# EAGLE design untitled (EAGLE 7.7.0)
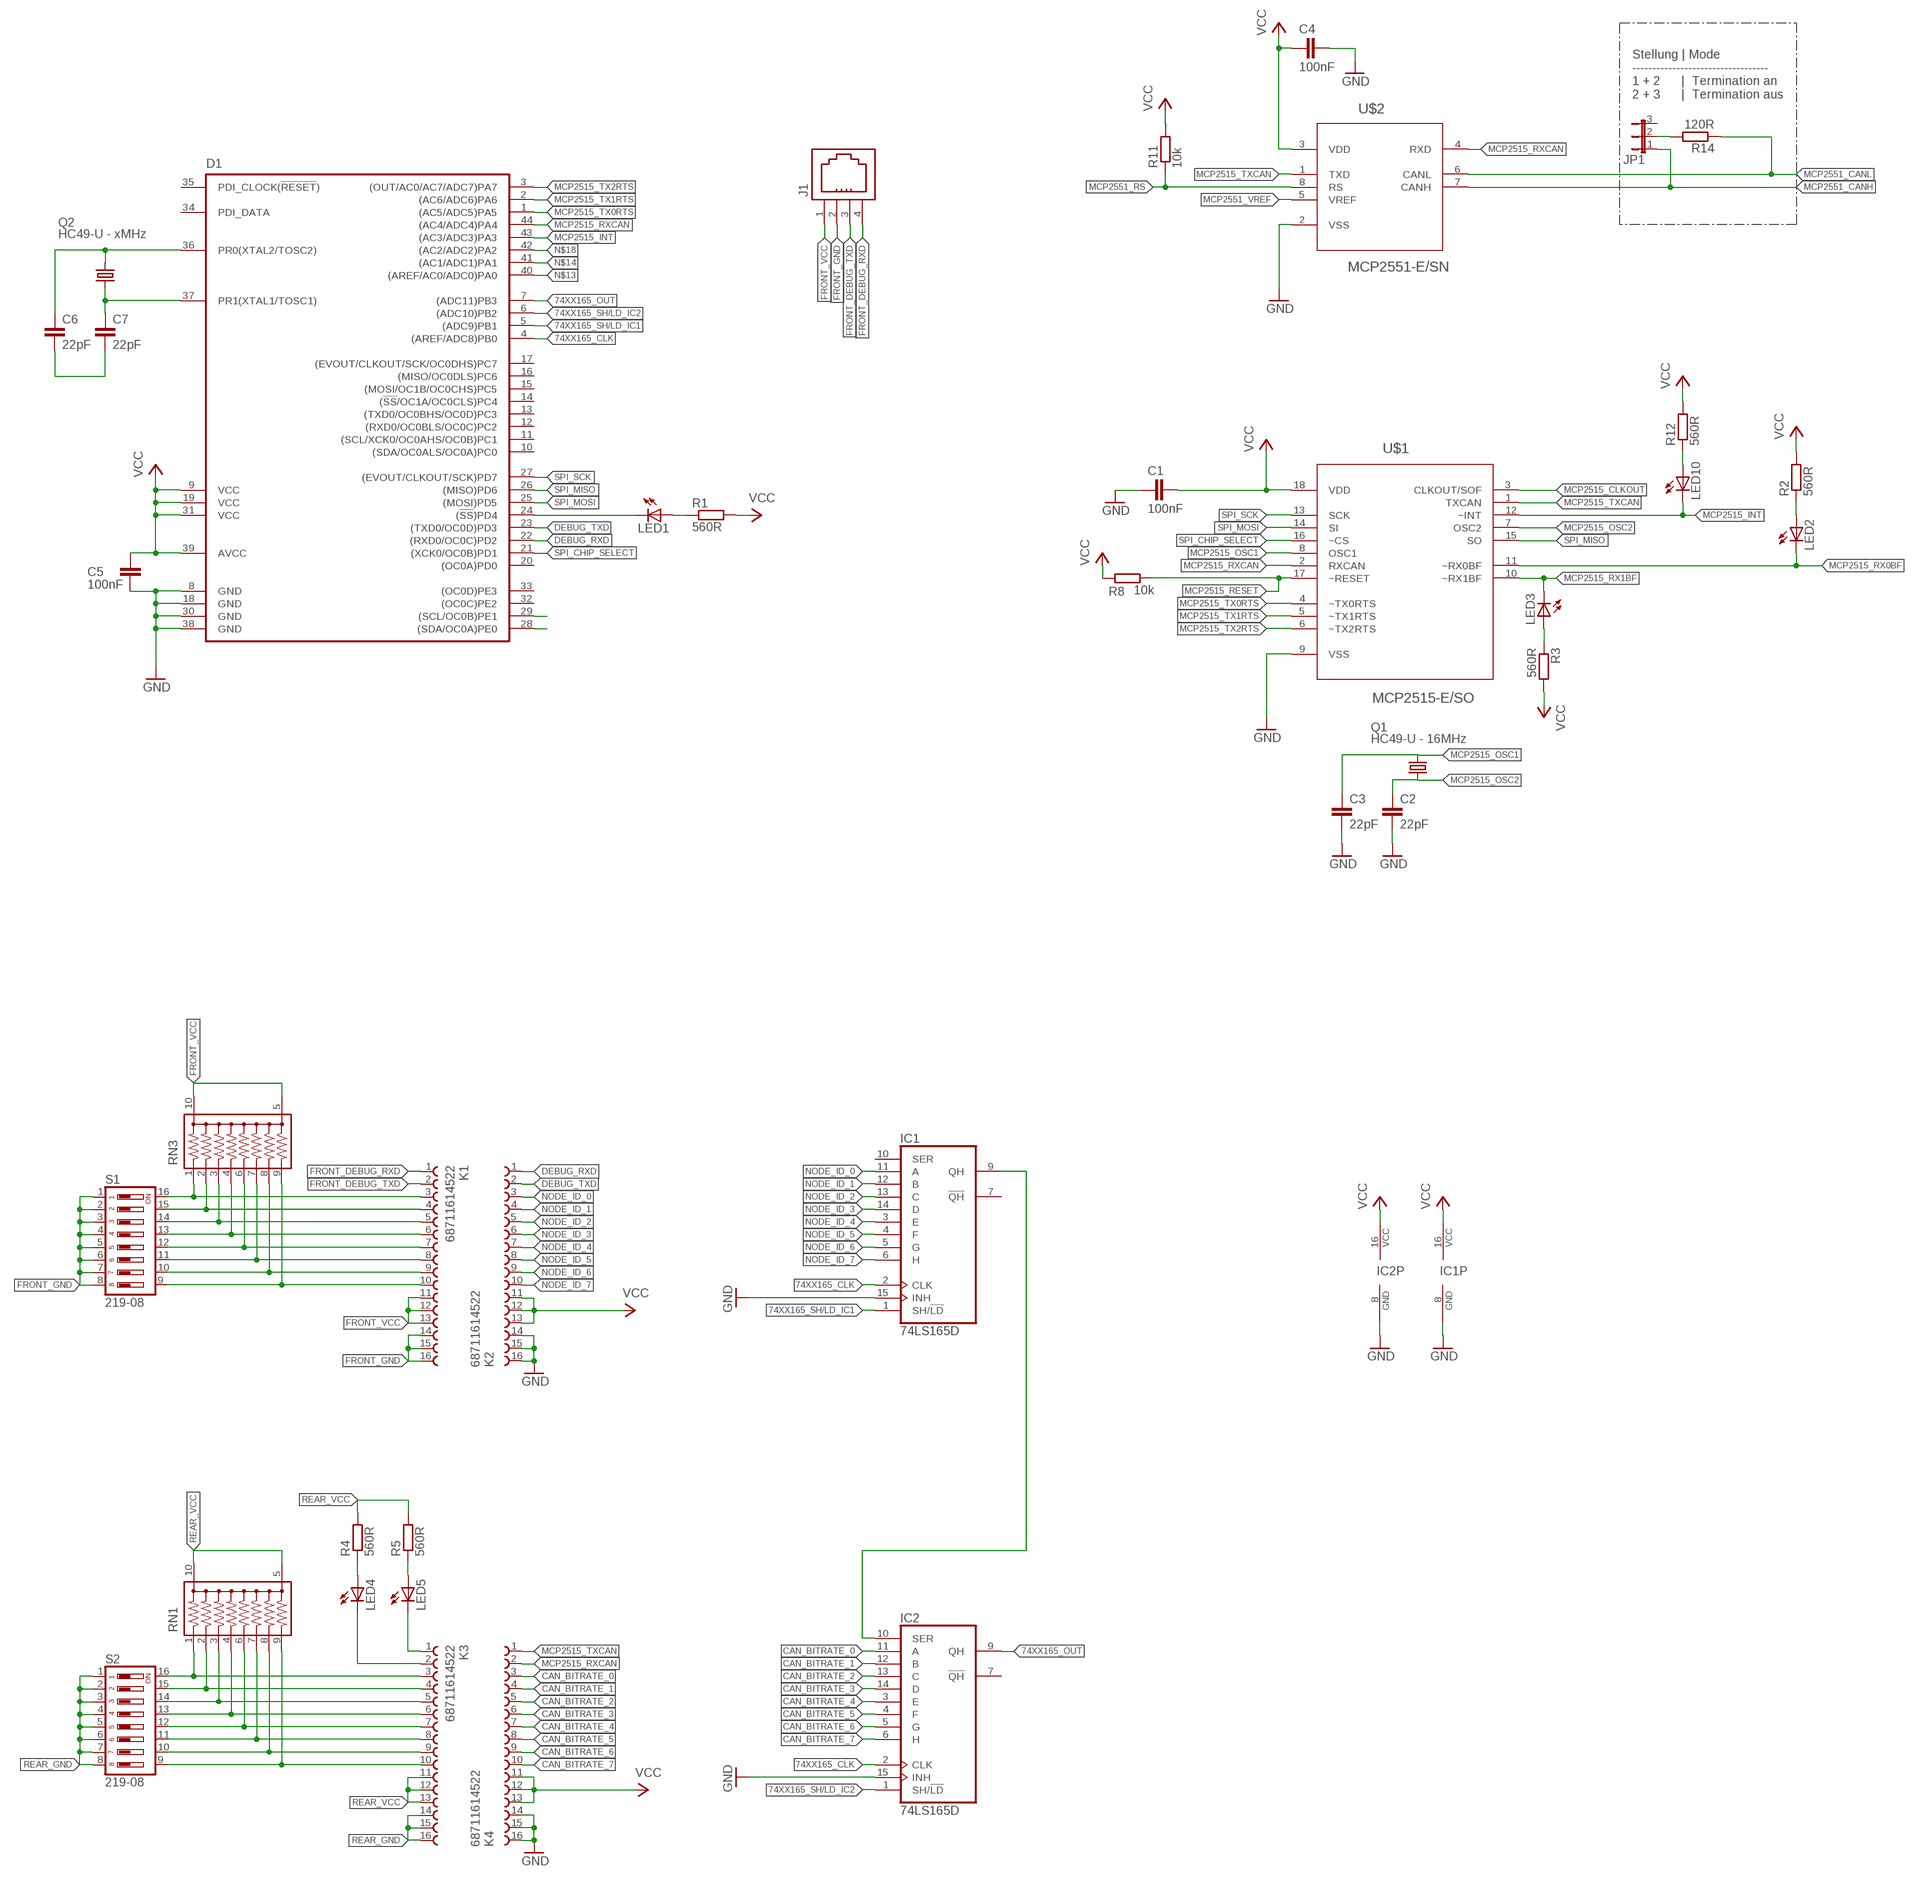
[diagram p0: schematic, sheet 1]

## Parts
C1  100nF  C-EUC1206  [C1206]
C2  22pF  C-EUC1206  [C1206]
C3  22pF  C-EUC1206  [C1206]
C4  100nF  C-EUC1206  [C1206]
C5  100nF  C-EUC1206  [C1206]
C6  22pF  C-EUC1206  [C1206]
C7  22pF  C-EUC1206  [C1206]
D1  ATXMEGA16D4/32D4/64D4/128D4-A  [TQFP44A]
IC1  74LS165D  [SO16]
IC2  74LS165D  [SO16]
J1  615004143821  [615004143821]
JP1  JP2E  [JP2]
K1  68711614522  [68711614522]
K2  68711614522  [68711614522]
K3  68711614522  [68711614522]
K4  68711614522  [68711614522]
LED1  LEDSML1206  [SML1206]
LED2  LEDSML1206  [SML1206]
LED3  LEDSML1206  [SML1206]
LED4  LEDSML1206  [SML1206]
LED5  LEDSML1206  [SML1206]
LED10  LEDSML1206  [SML1206]
Q1  HC49-U - 16MHz  HC49-U  [HC49]
Q2  HC49-U - xMHz  HC49-U  [HC49]
R1  560R  R-EU_R1206  [R1206]
R2  560R  R-EU_R1206  [R1206]
R3  560R  R-EU_R1206  [R1206]
R4  560R  R-EU_R1206  [R1206]
R5  560R  R-EU_R1206  [R1206]
R8  10k  R-EU_R1206  [R1206]
R11  10k  R-EU_R1206  [R1206]
R12  560R  R-EU_R1206  [R1206]
R14  120R  R-EU_R1206  [R1206]
RN1  745-10  [745-10]
RN3  745-10  [745-10]
S1  219-08  [CTS-219-08]
S2  219-08  [CTS-219-08]
U$1  MCP2515-E/SO  [SOIC127P1030X265-18N]
U$2  MCP2551-E/SN  [SOIC127P600X175-8N]

## Nets
74XX165_CLK: D1.4((AREF/ADC8)PB0) IC1.2(CLK) IC2.2(CLK)
74XX165_OUT: D1.7((ADC11)PB3) IC2.9(QH)
74XX165_SH/LD_IC1: D1.5((ADC9)PB1) IC1.1(SH/!LD)
74XX165_SH/LD_IC2: D1.6((ADC10)PB2) IC2.1(SH/!LD)
CAN_BITRATE_0: IC2.11(A) K4.3
CAN_BITRATE_1: IC2.12(B) K4.4
CAN_BITRATE_2: IC2.13(C) K4.5
CAN_BITRATE_3: IC2.14(D) K4.6
CAN_BITRATE_4: IC2.3(E) K4.7
CAN_BITRATE_5: IC2.4(F) K4.8
CAN_BITRATE_6: IC2.5(G) K4.9
CAN_BITRATE_7: IC2.6(H) K4.10
DEBUG_RXD: D1.22((RXD0/OC0C)PD2) K2.1
DEBUG_TXD: D1.23((TXD0/OC0D)PD3) K2.2
FRONT_DEBUG_RXD: J1.4 K1.1
FRONT_DEBUG_TXD: J1.3 K1.2
FRONT_GND: J1.2 K1.14 K1.15 K1.16 S1.1 S1.2 S1.3 S1.4 S1.5 S1.6 S1.7 S1.8
FRONT_VCC: J1.1 K1.11 K1.12 K1.13 RN3.5 RN3.10
GND: C1.2 C2.2 C3.2 C4.1 C5.2 D1.8(GND) D1.18(GND) D1.30(GND) D1.38(GND) IC1.8(GND) IC1.15(INH) IC2.8(GND) IC2.15(INH) K2.14 K2.15 K2.16 K4.14 K4.15 K4.16 U$1.9(VSS) U$2.2(VSS)
MCP2515_CLKOUT: U$1.3(CLKOUT/SOF)
MCP2515_INT: D1.43((AC3/ADC3)PA3) LED10.C U$1.12(~INT)
MCP2515_OSC1: C3.1 Q1.2 U$1.8(OSC1)
MCP2515_OSC2: C2.1 Q1.1 U$1.7(OSC2)
MCP2515_RESET: R8.1 U$1.17(~RESET)
MCP2515_RX0BF: LED2.C U$1.11(~RX0BF)
MCP2515_RX1BF: LED3.C U$1.10(~RX1BF)
MCP2515_RXCAN: D1.44((AC4/ADC4)PA4) K4.2 U$1.2(RXCAN) U$2.4(RXD)
MCP2515_TX0RTS: D1.1((AC5/ADC5)PA5) U$1.4(~TX0RTS)
MCP2515_TX1RTS: D1.2((AC6/ADC6)PA6) U$1.5(~TX1RTS)
MCP2515_TX2RTS: D1.3((OUT/AC0/AC7/ADC7)PA7) U$1.6(~TX2RTS)
MCP2515_TXCAN: K4.1 U$1.1(TXCAN) U$2.1(TXD)
MCP2551_CANH: JP1.1 U$2.7(CANH)
MCP2551_CANL: R14.1 U$2.6(CANL)
MCP2551_RS: R11.1 U$2.8(RS)
MCP2551_VREF: U$2.5(VREF)
N$1: LED2.A R2.1
N$2: IC1.9(QH) IC2.10(SER)
N$3: LED3.A R3.1
N$4: K3.3 RN1.1 S2.16
N$5: K3.4 RN1.2 S2.15
N$6: K3.5 RN1.3 S2.14
N$7: K3.6 RN1.4 S2.13
N$8: K3.7 RN1.6 S2.12
N$9: K3.8 RN1.7 S2.11
N$11: LED10.A R12.1
N$12: JP1.2 R14.2
N$13: D1.40((AREF/AC0/ADC0)PA0)
N$14: D1.41((AC1/ADC1)PA1)
N$15: C6.1 D1.36(PR0(XTAL2/TOSC2)) Q2.2
N$16: C7.1 D1.37(PR1(XTAL1/TOSC1)) Q2.1
N$17: C6.2 C7.2
N$18: D1.42((AC2/ADC2)PA2)
N$19: K3.9 RN1.8 S2.10
N$20: D1.28((SDA/OC0A)PE0)
N$21: D1.29((SCL/OC0B)PE1)
N$22: K1.3 RN3.1 S1.16
N$23: K1.4 RN3.2 S1.15
N$24: K1.5 RN3.3 S1.14
N$25: K1.6 RN3.4 S1.13
N$26: K1.7 RN3.6 S1.12
N$27: K1.8 RN3.7 S1.11
N$28: K1.9 RN3.8 S1.10
N$29: K1.10 RN3.9 S1.9
N$30: K3.10 RN1.9 S2.9
N$32: LED1.A R1.1
N$33: K3.1 LED5.C
N$34: K3.2 LED4.C
N$35: LED4.A R4.1
N$36: LED5.A R5.1
NODE_ID_0: IC1.11(A) K2.3
NODE_ID_1: IC1.12(B) K2.4
NODE_ID_2: IC1.13(C) K2.5
NODE_ID_3: IC1.14(D) K2.6
NODE_ID_4: IC1.3(E) K2.7
NODE_ID_5: IC1.4(F) K2.8
NODE_ID_6: IC1.5(G) K2.9
NODE_ID_7: IC1.6(H) K2.10
REAR_GND: K3.14 K3.15 K3.16 S2.1 S2.2 S2.3 S2.4 S2.5 S2.6 S2.7 S2.8
REAR_VCC: K3.11 K3.12 K3.13 R4.2 R5.2 RN1.5 RN1.10
SPI_CHIP_SELECT: D1.21((XCK0/OC0B)PD1) U$1.16(~CS)
SPI_MISO: D1.26((MISO)PD6) U$1.15(SO)
SPI_MOSI: D1.25((MOSI)PD5) U$1.14(SI)
SPI_SCK: D1.27((EVOUT/CLKOUT/SCK)PD7) U$1.13(SCK)
SPI_SLAVE_SELECT_HW: D1.24((!SS!)PD4) LED1.C
VCC: C1.1 C4.2 C5.1 D1.9(VCC) D1.19(VCC) D1.31(VCC) D1.39(AVCC) IC1.16(VCC) IC2.16(VCC) K2.11 K2.12 K2.13 K4.11 K4.12 K4.13 R1.2 R2.2 R3.2 R8.2 R11.2 R12.2 U$1.18(VDD) U$2.3(VDD)
Unconnected: D1.10((SDA/OC0ALS/OC0A)PC0) D1.11((SCL/XCK0/OC0AHS/OC0B)PC1) D1.12((RXD0/OC0BLS/OC0C)PC2) D1.13((TXD0/OC0BHS/OC0D)PC3) D1.14((!SS!/OC1A/OC0CLS)PC4) D1.15((MOSI/OC1B/OC0CHS)PC5) D1.16((MISO/OC0DLS)PC6) D1.17((EVOUT/CLKOUT/SCK/OC0DHS)PC7) D1.20((OC0A)PD0) D1.32((OC0C)PE2) D1.33((OC0D)PE3) D1.34(PDI_DATA) D1.35(PDI_CLOCK(!RESET!)) IC1.7(!QH) IC1.10(SER) IC2.7(!QH) JP1.3

## Notes on the sheet
- Stellung | Mode
  ----------------------------------
  1 + 2      |  Termination an
  2 + 3      |  Termination aus

## Library data of the parts
C1-C7 = rcl:C-EU: CAPACITOR, European symbol
D1 = AVR - XMEGA:ATXMEGA16D4/32D4/64D4/128D4-: Name des Bauteiles: -->ATxmega32D4-AU Daten:SMD-Microcontroller 8/16 Bit Artikelnummer:#045426 Datenblatt:Siehe Hesch Suche ! __________________________________________ generated by Eagle Description Tool am : 14.02.2017 11:35:40 erstellt von: Hm
IC1 IC2 = 74xx-us:74*165: 8-bit parallel load SHIFT REGISTER
J1 = InputOutputIO (rev18b):615004143821: WR-MJ Horizontal Plastic 4P4C Modular Jack Tab Up, 4 Pins=>Code : Con_I-O_MJ-H_Plastic_Up_615004143821 <http://katalog.we-online.de/media/images/eican/Con_I-O_MJ-H_Plastic_Up_615004143821_pf2.jpg> Details see: http://katalog.we-online.de/en/em/MJ_HORIZONTAL_PLASTIC_4P4C_TAB_UP Created 2014-07-10, Karrer Zheng 2014 (C) Würth Elektronik
JP1 = jumper:JP2E: JUMPER
K1-K4 = Wurth_FPC_FFC:68711614522: WE-FPC 0.5mm SMT ZIF Horizontal Bottom Contact, 16 Pins=>Code : Con_FPC_ZIF_0.50_68711614522 <http://katalog.we-online.de/media/images/eican/Con_FPC_ZIF_0.50_6871xx14522_pf2.jpg> Details see: http://katalog.we-online.de/en/em/687_1xx_145_22 Created 2014-07-09, Karrer Zheng 2014 (C) Würth Elektronik
LED1-LED5 LED10 = led:LED: LED OSRAM: - CHIPLED LG R971, LG N971, LY N971, LG Q971, LY Q971, LO R971, LY R971 LH N974, LH R974 LS Q976, LO Q976, LY Q976 LO Q996 - Hyper CHIPLED LW Q18S LB Q993, LB Q99A, LB R99A - SideLED LS A670, LO A670, LY A670, LG A670, LP A670 LB A673, LV A673, LT A673, LW A673 LH A674 LY A675 LS A676, LA A676, LO A676, LY A676, LW A676 LS A679, LY A679, LG A679 - Hyper Micro SIDELED® LS Y876, LA Y876, LO Y876, LY Y876 LT Y87S - SmartLED LW L88C, LW L88S LB L89C, LB L89S, LG L890 LS L89K, LO L89K, LY L89K LS L896, LA L896, LO L896, LY L896 - TOPLED LS T670, LO T670, LY T670, LG T670, LP T670 LSG T670, LSP T670, LSY T670, LOP T670, LYG T670 LG T671, LOG T671, LSG T671 LB T673, LV T673, LT T673, LW T673 LH T674 LS T676, LA T676, LO T676, LY T676, LB T676, LH T676, LSB T676, LW T676 LB T67C, LV T67C, LT T67C, LS T67K, LO T67K, LY T67K, LW E67C LS E67B, LA E67B, LO E67B, LY E67B, LB E67C, LV E67C, LT E67C LW T67C LS T679, LY T679, LG T679 LS T770, LO T770, LY T770, LG T770, LP T770 LB T773, LV T773, LT T773, LW T773 LH T774 LS E675, LA E675, LY E675, LS T675 LS T776, LA T776, LO T776, LY T776, LB T776 LHGB T686 LT T68C, LB T68C - Hyper Mini TOPLED® LB M676 - Mini TOPLED Santana® LG M470 LS M47K, LO M47K, LY M47K Source: http://www.osram.convergy.de LUXEON: - LUMILED® LXK2-PW12-R00, LXK2-PW12-S00, LXK2-PW14-U00, LXK2-PW14-V00 LXK2-PM12-R00, LXK2-PM12-S00, LXK2-PM14-U00 LXK2-PE12-Q00, LXK2-PE12-R00, LXK2-PE12-S00, LXK2-PE14-T00, LXK2-PE14-U00 LXK2-PB12-K00, LXK2-PB12-L00, LXK2-PB12-M00, LXK2-PB14-N00, LXK2-PB14-P00, LXK2-PB14-Q00 LXK2-PR12-L00, LXK2-PR12-M00, LXK2-PR14-Q00, LXK2-PR14-R00 LXK2-PD12-Q00, LXK2-PD12-R00, LXK2-PD12-S00 LXK2-PH12-R00, LXK2-PH12-S00 LXK2-PL12-P00, LXK2-PL12-Q00, LXK2-PL12-R00 Source: www.luxeon.com KINGBRIGHT: KA-3528ASYC Source: www.kingbright.com
Q1 Q2 = Quarz - HC49UP:HC49: Name des Bauteiles: -->HC49U/P Daten:16 MHz (16000000 Hz) Artikelnummer:#023006 Datenblatt:www.alldatasheet.com __________________________________________ generated by Eagle Description Tool am : 22.01.2014 13:23:52 erstellt von: Hm
R1-R5 R8 R11 R12 R14 = rcl:R-EU_: RESISTOR, European symbol
RN1 RN3 = resistor-array:745-10: CTS 745 Series 8 Resistors, 10 Terminations
S1 S2 = switch-dil:219-08*: Surface Mount DIP Switch Series 219 SMT CTS Electronic Components Sourc: www.ctscorp.com; OC_FARNELL: unknown; OC_NEWARK: unknown
U$1 = Microchip_By_element14_Batch_1:MCP2515-E/SO: Stand-Alone CAN Controller; DESCRIPTION: IC CAN CONTROLLER; MPN: MCP2515-E/SO; OC_FARNELL: 1605565; OC_NEWARK: 29H7134; PACKAGE: SOIC-18; SUPPLIER: Microchip
U$2 = Microchip_By_element14_Batch_1:MCP2551-E/SN: High-Speed CAN Transceiver; DESCRIPTION: High-Speed CAN Transceiver; MPN: MCP2551-E/SN; OC_FARNELL: 1467746; OC_NEWARK: 92C4186; PACKAGE: SOIC-8; SUPPLIER: Microchip

## Board
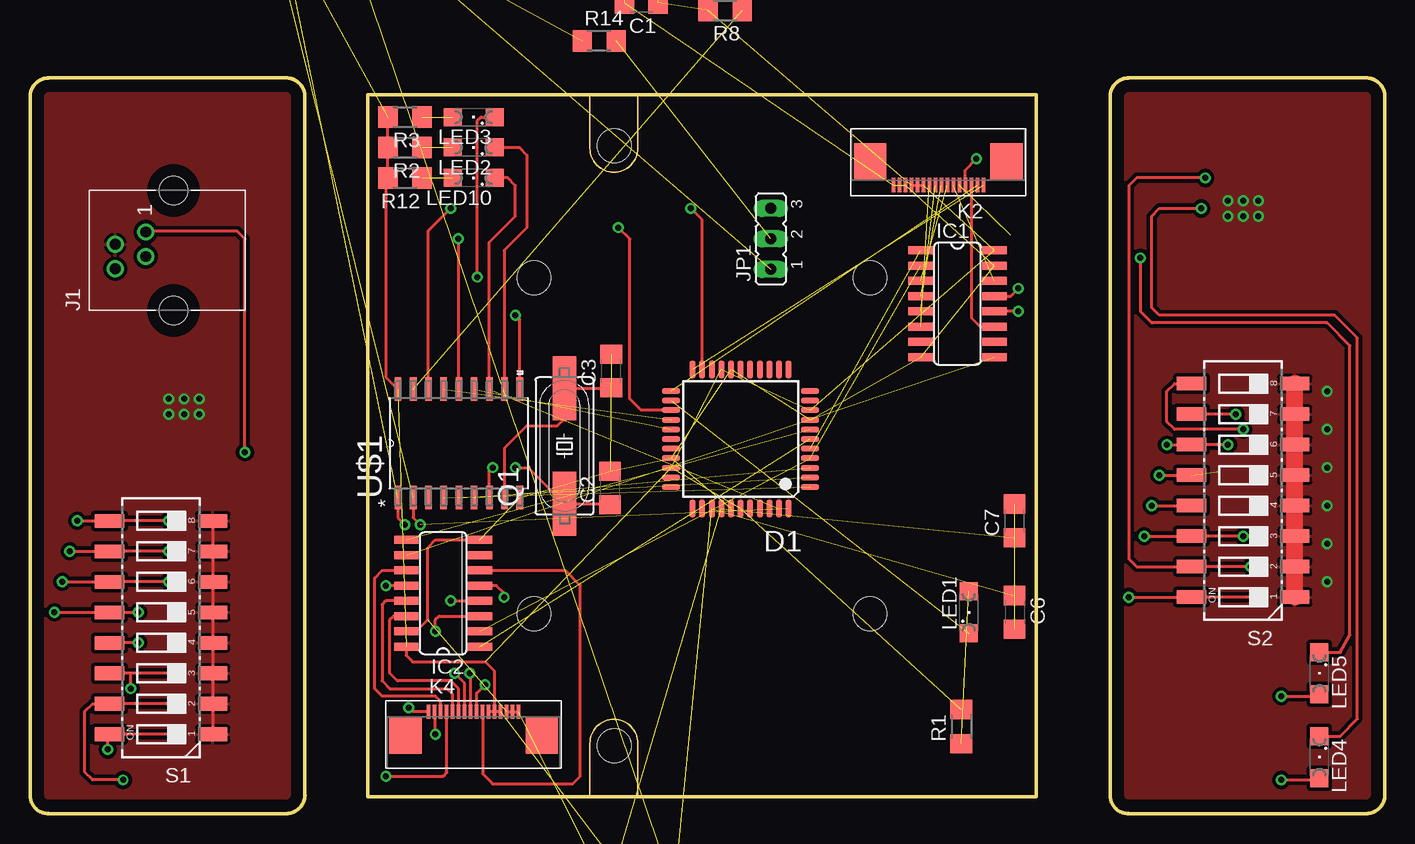
[diagram p1: board, top side]
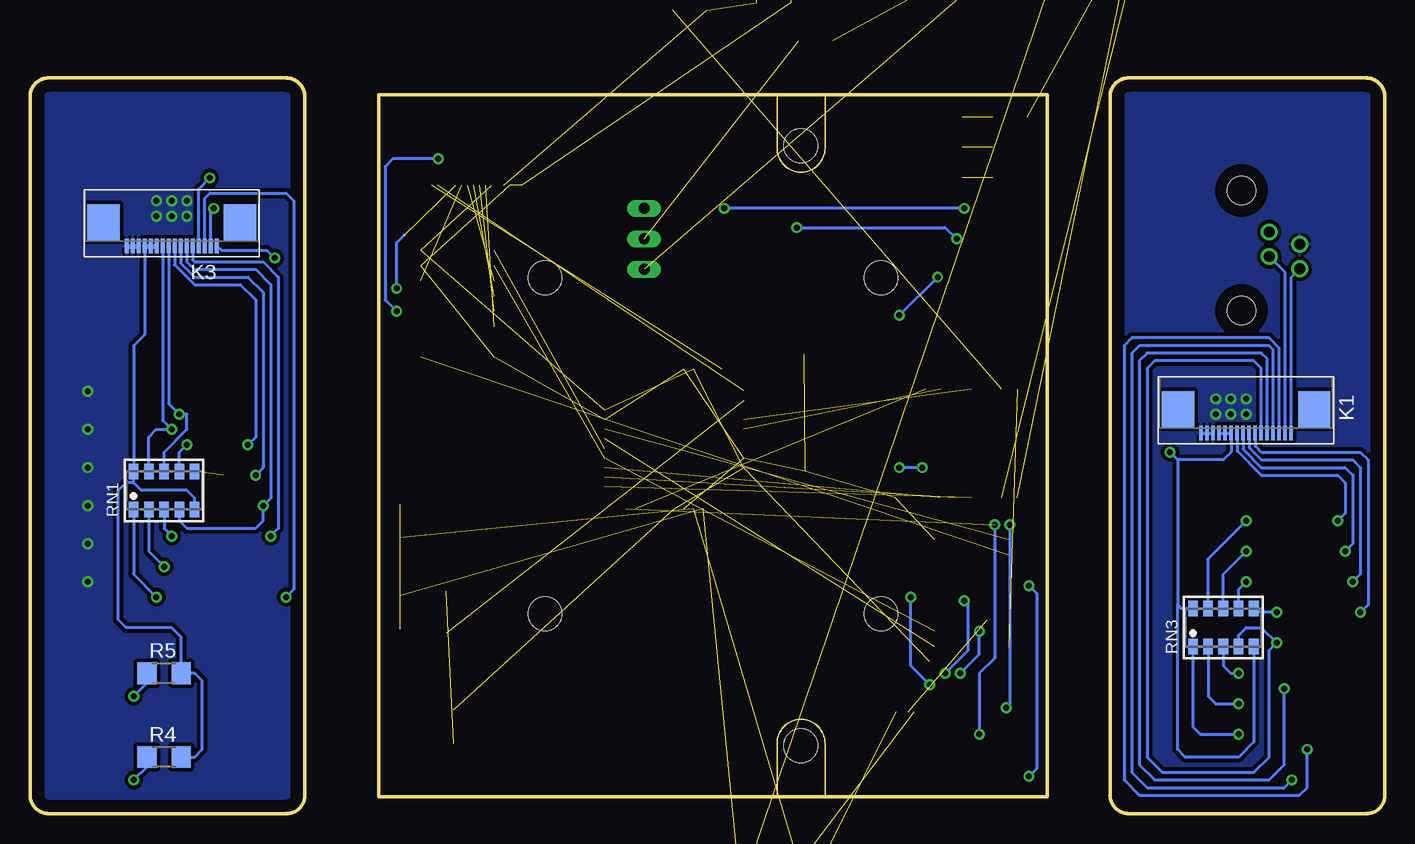
[diagram p2: board, bottom side, seen from below]

Size 112.91 x 61.32 mm. Coordinates in mm from the lower left corner, seen from the top.
Copper layers (1*16): Top 0.035mm / dielectric 1.5mm / Bottom 0.035mm
Design rules "default": minimum track width 10mil, minimum drill 24mil, track to track 8mil, track to pad 8mil, pad to pad 8mil, via to via 8mil, smd to smd 8mil, copper to edge 40mil, drill to drill 8mil, minimum pad ring 10mil, minimum via ring 8mil, stop-mask expansion 4mil, vias tented up to drill 0mil, thermal gap 10mil

### Footprints (pad centres in the part's own frame; a part is rotated, then mirrored left to right if it is on the bottom)
C1206 = smd 1.6 x 1.8: 1 -1.4,0; 2 1.4,0
TQFP44A = smd 1.5 x 0.5: 1 -5.8,4; 2 -5.8,3.2; 3 -5.8,2.4; 4 -5.8,1.6; 5 -5.8,0.8; 6 -5.8,0; 7 -5.8,-0.8; 8 -5.8,-1.6; 9 -5.8,-2.4; 10 -5.8,-3.2; 11 -5.8,-4; 23 5.8,-4; 24 5.8,-3.2; 25 5.8,-2.4; 26 5.8,-1.6; 27 5.8,-0.8; 28 5.8,0; 29 5.8,0.8; 30 5.8,1.6; 31 5.8,2.4; 32 5.8,3.2; 33 5.8,4 | smd 0.5 x 1.5: 12 -4,-5.8; 13 -3.2,-5.8; 14 -2.4,-5.8; 15 -1.6,-5.8; 16 -0.8,-5.8; 17 0,-5.8; 18 0.8,-5.8; 19 1.6,-5.8; 20 2.4,-5.8; 21 3.2,-5.8; 22 4,-5.8; 34 4,5.8; 35 3.2,5.8; 36 2.4,5.8; 37 1.6,5.8; 38 0.8,5.8; 39 0,5.8; 40 -0.8,5.8; 41 -1.6,5.8; 42 -2.4,5.8; 43 -3.2,5.8; 44 -4,5.8
SO16 = smd 0.66 x 2.032: 1 -4.445,-3.073; 2 -3.175,-3.073; 3 -1.905,-3.073; 4 -0.635,-3.073; 5 0.635,-3.073; 6 1.905,-3.073; 7 3.175,-3.073; 8 4.445,-3.073; 9 4.445,3.073; 10 3.175,3.073; 11 1.905,3.073; 12 0.635,3.073; 13 -0.635,3.073; 14 -1.905,3.073; 15 -3.175,3.073; 16 -4.445,3.073
615004143821 = drill 0.9: 1 1.53,2.3; 2 0.51,4.84; 3 -0.51,2.3; 4 -1.53,4.84 | hole 2.36: -5,0; 5,0
JP2 = drill 0.914 long: 1 -2.54,0; 2 0,0; 3 2.54,0
68711614522 = smd 0.3 x 1.2: 1 -3.75,0.6; 2 -3.25,0.6; 3 -2.75,0.6; 4 -2.25,0.6; 5 -1.75,0.6; 6 -1.25,0.6; 7 -0.75,0.6; 8 -0.25,0.6; 9 0.25,0.6; 10 0.75,0.6; 11 1.25,0.6; 12 1.75,0.6; 13 2.25,0.6; 14 2.75,0.6; 15 3.25,0.6; 16 3.75,0.6 | smd 2.7 x 3: Z1 -5.68,-1.38; Z2 5.68,-1.38
SML1206 = smd 1.5 x 1.5: A 1.75,0; C -1.75,0
HC49 = smd 5.334 x 1.93: 1 -4.826,0; 2 4.826,0
R1206 = smd 1.6 x 1.803: 1 -1.422,0; 2 1.422,0
745-10 = smd 0.8 x 1.3: 1 -2.54,-1.587; 2 -1.27,-1.587; 3 0,-1.587; 4 1.27,-1.587; 5 2.54,-1.587; 6 2.54,1.587; 7 1.27,1.587; 8 0,1.587; 9 -1.27,1.587; 10 -2.54,1.587
CTS-219-08 = smd 1.13 x 2.44: 1 -8.89,-4.3; 2 -6.35,-4.3; 3 -3.81,-4.3; 4 -1.27,-4.3; 5 1.27,-4.3; 6 3.81,-4.3; 7 6.35,-4.3; 8 8.89,-4.3; 9 8.89,4.3; 10 6.35,4.3; 11 3.81,4.3; 12 1.27,4.3; 13 -1.27,4.3; 14 -3.81,4.3; 15 -6.35,4.3; 16 -8.89,4.3
SOIC127P1030X265-18N = smd 1.981 x 0.559: 1 -4.521,5.08; 2 -4.521,3.81; 3 -4.521,2.54; 4 -4.521,1.27; 5 -4.521,0; 6 -4.521,-1.27; 7 -4.521,-2.54; 8 -4.521,-3.81; 9 -4.521,-5.08; 10 4.521,-5.08; 11 4.521,-3.81; 12 4.521,-2.54; 13 4.521,-1.27; 14 4.521,0; 15 4.521,1.27; 16 4.521,2.54; 17 4.521,3.81; 18 4.521,5.08
SOIC127P600X175-8N = smd 1.981 x 0.559: 1 -2.362,1.905; 2 -2.362,0.635; 3 -2.362,-0.635; 4 -2.362,-1.905; 5 2.362,-1.905; 6 2.362,-0.635; 7 2.362,0.635; 8 2.362,1.905
RND_455-00879_X4 = hole 2.8: -14,-13.54; 14,-13.54; -14,14.46; 14,14.46; -25,7.78; 25,7.78

### Placement (x,y rotation side)
C1  50.93,67.58 180 top  (outside the outline)
C2  48.35,27.15 90 top
C3  48.44,36.9 90 top
C4  50.3,76.47 0 top  (outside the outline)
C5  50.3,-7.98 180 top  (outside the outline)
C6  82.05,16.78 270 top
C7  82.05,24.4 90 top
D1  59.22,31.23 180 top
IC1  77.29,42.5 270 top
IC2  34.42,18.37 90 top
J1  11.95,46.94 90 top
JP1  61.73,47.9 90 top
K1  11.57,32.31 180 bottom
K2  75.7,52.98 180 top
K3  101.1,47.9 180 bottom
K4  36.96,7.89 0 top
LED1  78.24,16.78 90 top
LED2  36.96,55.52 180 top
LED3  36.96,58.06 180 top
LED4  107.45,4.72 270 top
LED5  107.45,11.7 270 top
LED10  36.96,52.98 180 top
Q1  44.54,30.64 90 top
Q2  46.81,-27.35 0 top  (outside the outline)
R1  77.6,7.26 90 top
R2  31.25,55.52 180 top
R3  31.25,58.06 180 top
R4  101.73,4.72 0 bottom
R5  101.73,11.7 0 bottom
R8  57.92,66.94 180 top  (outside the outline)
R11  55.06,-11.8 270 top  (outside the outline)
R12  31.25,52.98 180 top
R14  47.44,64.41 0 top  (outside the outline)
RN1  101.73,26.94 0 bottom
RN3  13.47,15.51 0 bottom
S1  10.93,15.51 90 top
S2  101.1,26.94 90 top
U$1  35.74,30.86 90 top
U$2  22.31,76.68 0 top  (outside the outline)
U$3  [RND_455-00879_X4]  56.46,30.66 90 top
U$4  [25X25_BEST]  95.38,8.52 100 top

### Tracks (layer width: path | path; a pad name or v marks a point on that pad's centre or on a via)
74XX165_CLK  (2 unrouted)
74XX165_OUT  (1 unrouted)
74XX165_SH/LD_IC1  (1 unrouted)
74XX165_SH/LD_IC2  (1 unrouted)
CAN_BITRATE_0
  Top 0.254: K4.3 34.21,9.37 33.79,9.8 29.35,9.8 28.71,10.43 28.71,19.64 29.35,20.27 IC2.11
CAN_BITRATE_1  (via drill 0.5)
  Top 0.254: IC2.12 v29.66,19 | v29.66,3.13 34.43,3.13 34.74,3.45 34.74,8.46 K4.4
  Bottom 0.254: v29.66,19 29.03,18.37 29.03,3.76 v29.66,3.13
CAN_BITRATE_2
  Top 0.254: IC2.13 29.66,17.73 29.35,17.42 29.35,11.07 29.98,10.43 34.74,10.43 35.21,9.96 K4.5
CAN_BITRATE_3
  Top 0.254: K4.6 35.71,10.41 35.06,11.07 30.61,11.07 29.98,11.7 29.98,16.15 30.3,16.46 IC2.14
CAN_BITRATE_4  (via drill 0.5)
  Top 0.254: K4.7 36.21,10.86 v35.38,11.7 | v33.79,15.19 33.79,16.15 34.11,16.46 IC2.3
  Bottom 0.254: v35.38,11.7 33.79,13.29 v33.79,15.19
CAN_BITRATE_5  (via drill 0.5)
  Top 0.254: K4.8 36.71,11.63 v36.65,11.7 | v35.06,17.73 IC2.4
  Bottom 0.254: v36.65,11.7 34.74,13.61 34.74,17.42 v35.06,17.73
CAN_BITRATE_6  (via drill 0.5)
  Top 0.254: K4.9 37.21,10.05 v37.92,10.75 | v39.5,18.05 39.5,18.37 38.87,19 IC2.5
  Bottom 0.254: v37.92,10.75 39.5,12.34 v39.5,18.05
CAN_BITRATE_7
  Top 0.254: K4.10 37.71,3.33 38.55,2.49 45.22,2.49 45.86,3.13 45.86,19 44.58,20.27 IC2.6
DEBUG_RXD  (1 unrouted)
DEBUG_TXD  (1 unrouted)
FRONT_DEBUG_RXD
  Bottom 0.254: K1.1 7.82,44.7 J1.4
FRONT_DEBUG_TXD
  Bottom 0.254: K1.2 8.32,45.1 J1.3
FRONT_GND  (via drill 0.5)
  Top 0.254: S1.8 S1.7 S1.6 S1.5 S1.4 S1.3 S1.2 S1.1
  Bottom 0.254: K1.16 K1.15 K1.14
  other vias: 14.1,33.29 14.1,34.56 12.83,34.56 12.83,33.29 11.56,33.29 11.56,34.56
  pour Top (isolate 0.305): 23.63,61.87 23.63,-1 -0.5,-1 -0.5,61.87
  pour Bottom (isolate 0.305): 23.63,61.87 23.63,-1 -0.5,-1 -0.5,61.87
FRONT_VCC  (via drill 0.5)
  Top 0.254: v17.92,30.12 17.92,47.9 17.28,48.53 9.71,48.53 J1.1
  Bottom 0.254: K1.13 K1.12 K1.11 12.82,30.13 13.47,29.48 17.28,29.48 | 17.28,29.48 v17.92,30.12 | 17.28,29.48 17.28,17.42 | RN3.10 16.96,17.1 17.28,17.42 | RN3.5 10.93,5.98 12.2,4.72 16.64,4.72 17.28,5.35 17.28,17.42
GND  (17 unrouted)
  Top 0.254: K4.14 K4.15 K4.16 | IC2.15 32.2,15.19 33.15,16.15 33.15,22.18 33.79,22.81 IC2.8
MCP2515_INT  (1 unrouted)
  Top 0.254: U$1.12 38.28,47.62 40.46,49.8 40.46,52.34 39.82,52.98 LED10.C
MCP2515_OSC1
  Top 0.254: C3.1 48.41,35.46 Q1.2 44.58,35.42 44.58,32.97 43.95,32.34 41.41,32.34 39.55,30.48 U$1.8
MCP2515_OSC2  (via drill 0.5)
  Top 0.254: C2.1 48.28,25.81 Q1.1 41.51,28.85 v40.46,28.85 | U$1.7 38.28,28.57 v38.55,28.85
  Bottom 0.254: v38.55,28.85 v40.46,28.85
MCP2515_RESET  (1 unrouted)
MCP2515_RX0BF
  Top 0.254: LED2.C 40.78,55.52 41.41,54.88 41.41,48.85 39.5,46.94 39.5,35.43 U$1.11
MCP2515_RX1BF  (via drill 0.5)
  Top 0.254: U$1.10 40.82,41.18 v40.46,41.55 | v37.28,44.72 37.28,57.74 37.6,58.06 LED3.C
  Bottom 0.254: v40.46,41.55 v37.28,44.72
MCP2515_RXCAN  (via drill 0.5)  (2 unrouted)
  Top 0.254: U$1.2 31.93,24.67 v32.52,24.08 | K4.2 33.71,6.7 v33.79,6.62
  Bottom 0.254: v32.52,24.08 32.52,12.97 33.79,11.7 v33.79,6.62
MCP2515_TX0RTS  (1 unrouted)
MCP2515_TX1RTS  (1 unrouted)
MCP2515_TX2RTS  (1 unrouted)
MCP2515_TXCAN  (via drill 0.5)  (1 unrouted)
  Top 0.254: U$1.1 30.66,24.67 v31.25,24.08 | v31.57,8.84 31.89,8.52 33.18,8.52 K4.1
  Bottom 0.254: v31.25,24.08 31.25,9.16 v31.57,8.84
MCP2551_CANH  (1 unrouted)
MCP2551_CANL  (1 unrouted)
MCP2551_RS  (1 unrouted)
N$1  (1 unrouted)
N$2  (1 unrouted)
N$3  (1 unrouted)
N$4  (via drill 0.5)
  Top 0.254: v91.57,18.05 S2.16 v102.37,18.05
  Bottom 0.254: K3.3 98.35,51.28 97.92,51.7 91.57,51.7 90.94,51.07 90.94,18.69 v91.57,18.05 | RN1.1 104.28,19.96 v102.37,18.05
N$5  (via drill 0.5)
  Top 0.254: v97.92,52.98 92.21,52.98 91.57,52.34 91.57,21.23 92.21,20.59 S2.15 v101.73,20.59
  Bottom 0.254: K3.4 98.85,52.05 v97.92,52.98 | RN1.2 103.01,21.86 v101.73,20.59
N$6  (via drill 0.5)
  Top 0.254: v92.84,23.13 S2.14 v101.1,23.13
  Bottom 0.254: K3.5 99.35,46.15 99.2,45.99 93.48,45.99 92.21,44.72 92.21,23.77 v92.84,23.13 | RN1.3 101.73,23.77 v101.1,23.13
N$7  (via drill 0.5)
  Top 0.254: v93.48,25.67 S2.13
  Bottom 0.254: K3.6 99.85,46.01 99.2,45.36 94.12,45.36 92.84,44.09 92.84,26.3 v93.48,25.67 93.48,24.4 94.12,23.77 99.83,23.77 100.46,24.4 RN1.4
N$8  (via drill 0.5)  (1 unrouted)
  Top 0.254: v94.12,28.21 S2.12
  Bottom 0.254: K3.7 100.35,45.88 99.2,44.72 94.75,44.72 93.48,43.45 93.48,28.85 v94.12,28.21
N$9  (via drill 0.5)
  Top 0.254: v94.75,30.75 S2.11 v99.83,30.75
  Bottom 0.254: K3.8 100.85,45.74 99.2,44.09 95.39,44.09 94.12,42.82 94.12,31.39 v94.75,30.75 | RN1.7 100.46,30.12 v99.83,30.75
N$11  (1 unrouted)
N$12  (1 unrouted)
N$15  (2 unrouted)
N$16  (2 unrouted)
N$17  (1 unrouted)
N$19  (via drill 0.5)
  Top 0.254: v100.46,33.29 S2.10
  Bottom 0.254: K3.9 101.35,34.18 v100.46,33.29 99.83,33.29 99.83,32.02 101.73,30.12 RN1.8
N$22  (via drill 0.5)
  Top 0.254: v12.2,6.62 S1.16 6.48,6.48 v6.48,5.35
  Bottom 0.254: RN3.1 16.01,7.26 15.37,6.62 v12.2,6.62 | K1.3 8.82,38.8 9.66,39.64 21.09,39.64 21.72,39.01 21.72,2.81 20.46,1.54 7.12,1.54 6.48,2.18 v6.48,5.35
N$23  (via drill 0.5)
  Top 0.254: v12.2,9.16 S1.15 5.21,9.16 4.58,8.52 4.58,3.45 5.21,2.81 v7.75,2.81
  Bottom 0.254: RN3.2 14.74,9.8 14.11,9.16 v12.2,9.16 | K1.4 9.32,38.66 9.66,39.01 20.46,39.01 21.09,38.37 21.09,3.45 19.82,2.18 8.39,2.18 v7.75,2.81
N$24  (via drill 0.5)
  Top 0.254: v12.2,11.7 8.39,11.7 | 8.39,11.7 S1.14 | v8.39,10.43 8.39,11.7
  Bottom 0.254: RN3.3 13.47,12.34 12.84,11.7 v12.2,11.7 | K1.5 9.82,37.9 10.29,38.37 19.82,38.37 20.46,37.73 20.46,4.08 19.18,2.81 9.66,2.81 8.39,4.08 v8.39,10.43
N$25  (via drill 0.5)
  Top 0.254: v9.02,14.24 S1.13
  Bottom 0.254: RN3.4 12.2,14.88 11.57,15.51 10.29,15.51 v9.02,14.24 9.66,13.61 9.66,4.72 10.93,3.45 18.55,3.45 19.82,4.72 19.82,37.1 19.18,37.73 10.93,37.73 10.32,37.12 K1.6
N$26  (via drill 0.5)
  Top 0.254: v9.02,16.78 S1.12 v2.04,16.78
  Bottom 0.254: v9.02,16.78 10.61,16.78 RN3.6 | K1.7 10.82,30.64 10.29,30.12 2.04,30.12 1.41,29.48 1.41,17.42 v2.04,16.78
N$27  (via drill 0.5)
  Top 0.254: v11.57,19.32 S1.11 v2.68,19.32
  Bottom 0.254: RN3.7 12.2,18.69 v11.57,19.32 | K1.8 11.32,30.51 10.29,29.48 2.68,29.48 2.04,28.85 2.04,19.96 v2.68,19.32
N$28  (via drill 0.5)
  Top 0.254: v11.57,21.86 S1.10 v3.31,21.86
  Bottom 0.254: RN3.8 13.47,19.96 v11.57,21.86 | K1.9 11.82,30.37 10.29,28.85 3.31,28.85 2.68,28.21 2.68,22.5 v3.31,21.86
N$29  (via drill 0.5)
  Top 0.254: v11.57,24.4 S1.9 v3.95,24.4
  Bottom 0.254: RN3.9 14.74,21.23 v11.57,24.4 | K1.10 12.32,30.23 10.29,28.21 3.95,28.21 3.31,27.58 3.31,25.04 v3.95,24.4
N$30  (via drill 0.5)
  Top 0.254: v101.1,32.02 95.39,32.02 94.75,32.66 94.75,35.2 95.39,35.83 S2.9
  Bottom 0.254: K3.10 101.85,32.77 v101.1,32.02 102.37,32.02 103.01,31.39 RN1.9
N$32  (1 unrouted)
N$33  (via drill 0.5)
  Top 0.254: LED5.C 109.2,13.45 109.99,14.88 109.99,39.01 108.09,40.91 93.48,40.91 92.53,41.86 v92.53,46.31
  Bottom 0.254: K3.1 97.31,47.26 97.29,47.26 96.97,46.94 93.16,46.94 v92.53,46.31
N$34  (via drill 0.5)
  Top 0.254: LED4.C 109.2,6.47 110.62,7.89 110.62,39.64 108.72,41.55 94.12,41.55 93.48,42.18 93.48,49.8 94.12,50.44 v97.61,50.44
  Bottom 0.254: K3.2 97.85,50.19 v97.61,50.44
N$35  (via drill 0.5)
  Top 0.254: v104.28,2.81 107.29,2.81 LED4.A
  Bottom 0.254: R4.1 103.16,3.93 v104.28,2.81
N$36  (via drill 0.5)
  Top 0.254: v104.28,9.8 107.29,9.8 LED5.A
  Bottom 0.254: R5.1 103.16,10.91 v104.28,9.8
NODE_ID_0
  Top 0.254: K2.3 78.45,41.34 79.19,40.59 IC1.11
NODE_ID_1  (via drill 0.5)
  Top 0.254: K2.4 77.95,53.64 v78.87,54.56 | v82.37,41.86 IC1.12
  Bottom 0.254: v78.87,54.56 82.68,54.56 83.32,53.93 83.32,42.82 v82.37,41.86
NODE_ID_2  (via drill 0.5)  (1 unrouted)
  Top 0.254: IC1.13 81.73,43.13 v82.37,43.77
  Bottom 0.254: v82.37,43.77 82.37,47.58 81.73,48.21
NODE_ID_3  (1 unrouted)
NODE_ID_4  (1 unrouted)
NODE_ID_5  (1 unrouted)
NODE_ID_6  (1 unrouted)
NODE_ID_7  (1 unrouted)
REAR_GND  (via drill 0.5)
  Top 1.422: S2.1 S2.2 S2.3 S2.4 S2.5 S2.6 S2.7 S2.8
  Bottom 0.406: K3.16 K3.14
  other vias: 99.83,49.8 101.1,49.8 102.37,49.8 102.37,51.07 101.1,51.07 99.83,51.07 108.08,19.32 108.08,22.5 108.08,25.67 108.08,28.85 108.08,32.02 108.08,35.2
  pour Top (isolate 0.305): 113.8,62.5 113.8,-1 89.03,-1 89.03,62.5
  pour Bottom (isolate 0.305): 113.8,62.5 113.8,-1 89.03,-1 89.03,62.5
REAR_VCC
  Bottom 0.254: RN1.5 99.2,26.3 99.83,26.94 103.64,26.94 104.28,27.58 | 104.28,27.58 RN1.10 104.28,39.01 103.35,39.93 K3.13 | R4.2 99.2,4.72 98.56,5.35 98.56,11.07 99.2,11.7 R5.2 100.31,14.72 101.1,15.51 104.91,15.51 105.54,16.15 105.54,26.94 104.91,27.58 104.28,27.58
  Bottom 0.406: K3.13 K3.12 K3.11
SPI_CHIP_SELECT  (via drill 0.5)
  Top 0.254: U$1.16 33.2,48.58 v35.06,50.44 | D1.21 56.02,49.48 v55.06,50.44
  Bottom 0.254: v35.06,50.44 v55.06,50.44
SPI_MISO  (1 unrouted)
SPI_MOSI  (via drill 0.5)
  Top 0.254: D1.25 50.92,33.62 49.98,34.56 49.98,47.9 v49.03,48.85 | v35.69,47.9 35.69,35.43 U$1.14
  Bottom 0.254: v49.03,48.85 36.65,48.85 v35.69,47.9
SPI_SCK  (1 unrouted)
SPI_SLAVE_SELECT_HW  (1 unrouted)
VCC  (14 unrouted)
  Top 0.254: IC2.16 31.35,13.19 31.89,12.65 37.92,12.65 38.71,11.86 K4.12 | K4.13 K4.12 | K4.12 K4.11 | R3.2 R2.2 R12.2 29.66,52.81 29.66,36.38 U$1.18 | K2.13 K2.12 K2.11

### Text on the board
Beschriftungen: TxD | RxD